# Altium schematic sheet LED.SchDoc
size A
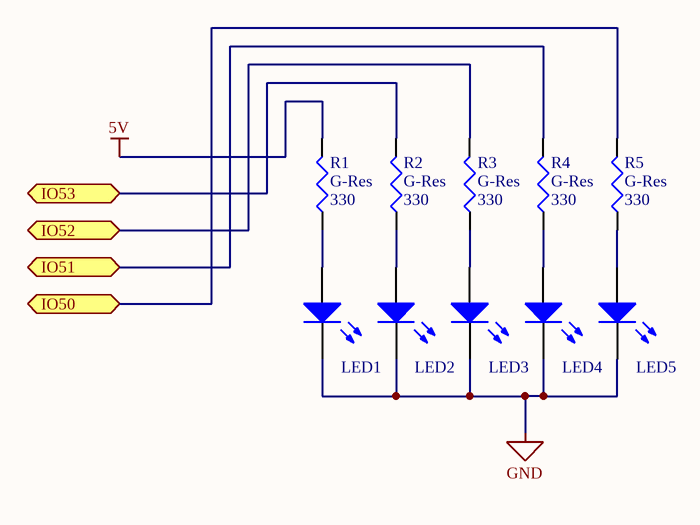
[diagram p0: LED.SchDoc]

## Parts
LED1  C503B-RAN-CY0B0AA1  [LED_LGE1.0]  (value not drawn)
LED2  C503B-RAN-CY0B0AA1  [LED_LGE1.0]  (value not drawn)
LED3  C503B-RAN-CY0B0AA1  [LED_LGE1.0]  (value not drawn)
LED4  C503B-RAN-CY0B0AA1  [LED_LGE1.0]  (value not drawn)
LED5  C503B-RAN-CY0B0AA1  [LED_LGE1.0]  (value not drawn)
R1  G-Res  value 330  [Res10mm_LGE1.0]
R2  G-Res  value 330  [Res10mm_LGE1.0]
R3  G-Res  value 330  [Res10mm_LGE1.0]
R4  G-Res  value 330  [Res10mm_LGE1.0]
R5  G-Res  value 330  [Res10mm_LGE1.0]

## Ports
IO50 (bidir), IO51 (bidir), IO52 (bidir), IO53 (bidir)

## Nets
5V: R1.2
GND: LED1.2(K) LED2.2(K) LED3.2(K) LED4.2(K) LED5.2(K)
IO50: R5.2 ; port IO50
IO51: R4.2 ; port IO51
IO52: R3.2 ; port IO52
IO53: R2.2 ; port IO53
NetLED1_1: LED1.1(A) R1.1
NetLED2_1: LED2.1(A) R2.1
NetLED3_1: LED3.1(A) R3.1
NetLED4_1: LED4.1(A) R4.1
NetLED5_1: LED5.1(A) R5.1

## Library data of the parts
LED1-LED5 = T-LEDRedHI: LED (high intensity - red); ComponentLink1URL: http://www.cree.com/~/media/Files/Cree/LED%20Components%20and%20Modules/HB/Data%20Sheets/C503B%20RAS%20RAN%20AAS%20AAN%20RBS%20RBN%20ABS%20ABN%20RCS%20RCN%20ACS%20ACN%201079.pdf; ComponentLink1Description: Datasheet (ELEC391)
R1-R5 = G-Res: Resistor (specify value); Published: 8-Jun-2000; LatestRevisionDate: 29-May-2009; LatestRevisionNote: IPC-7351 Footprint Added.; PackageReference: J1-0603; Publisher: Altium Limited; PackageDescription: Chip Resistor